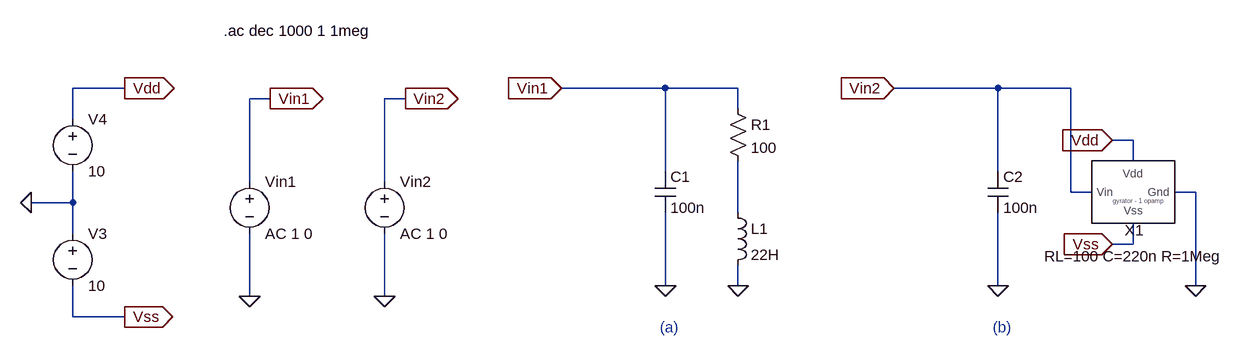
[diagram p0: schematic parallel resonant circuit.asc]
parallel resonant circuit.asc, the LTspice schematic file:
Version 4
SHEET 1 1184 680
WIRE -592 176 -672 176
WIRE 240 176 80 176
WIRE 352 176 240 176
WIRE 752 176 592 176
WIRE 864 176 752 176
WIRE -368 192 -400 192
WIRE -160 192 -192 192
WIRE 352 208 352 176
WIRE -672 224 -672 176
WIRE 960 256 928 256
WIRE 960 288 960 256
WIRE 240 304 240 176
WIRE 752 304 752 176
WIRE -400 320 -400 192
WIRE -192 320 -192 192
WIRE 864 336 864 176
WIRE 896 336 864 336
WIRE 1056 336 1024 336
WIRE -672 352 -672 304
WIRE -672 352 -736 352
WIRE 352 368 352 288
WIRE -672 400 -672 352
WIRE 960 416 960 384
WIRE 960 416 928 416
WIRE 240 480 240 368
WIRE 352 480 352 448
WIRE 752 480 752 368
WIRE 1056 480 1056 336
WIRE -400 496 -400 400
WIRE -192 496 -192 400
WIRE -672 528 -672 480
WIRE -592 528 -672 528
FLAG -400 496 0
FLAG 240 480 0
FLAG 352 480 0
FLAG -368 192 Vin1
IOPIN -368 192 Out
FLAG 80 176 Vin1
IOPIN 80 176 In
FLAG 752 480 0
FLAG 592 176 Vin2
IOPIN 592 176 In
FLAG 1056 480 0
FLAG -736 352 0
FLAG -592 176 Vdd
IOPIN -592 176 Out
FLAG -592 528 Vss
IOPIN -592 528 Out
FLAG 928 416 Vss
IOPIN 928 416 In
FLAG 928 256 Vdd
IOPIN 928 256 In
FLAG -192 496 0
FLAG -160 192 Vin2
IOPIN -160 192 Out
SYMBOL voltage -400 304 R0
WINDOW 123 0 0 Left 0
WINDOW 39 0 0 Left 0
SYMATTR InstName Vin1
SYMATTR Value AC 1 0
SYMBOL cap 224 304 R0
SYMATTR InstName C1
SYMATTR Value 100n
SYMBOL res 336 192 R0
SYMATTR InstName R1
SYMATTR Value 100
SYMBOL ind 336 352 R0
SYMATTR InstName L1
SYMATTR Value 22H
SYMBOL cap 736 304 R0
SYMATTR InstName C2
SYMATTR Value 100n
SYMBOL Gyr1 960 352 R0
WINDOW 39 2 98 Bottom 2
SYMATTR InstName X1
SYMATTR SpiceLine RL=100 C=220n R=1Meg
SYMBOL voltage -672 208 R0
WINDOW 123 0 0 Left 0
WINDOW 39 0 0 Left 0
SYMATTR InstName V4
SYMATTR Value 10
SYMBOL voltage -672 384 R0
WINDOW 123 0 0 Left 0
WINDOW 39 0 0 Left 0
SYMATTR InstName V3
SYMATTR Value 10
SYMBOL voltage -192 304 R0
WINDOW 123 0 0 Left 0
WINDOW 39 0 0 Left 0
SYMATTR InstName Vin2
SYMATTR Value AC 1 0
TEXT -440 88 Left 2 !.ac dec 1000 1 1meg
TEXT 232 544 Left 2 ;(a)
TEXT 744 544 Left 2 ;(b)

The netlist it stands for:
* parallel resonant circuit.asc
Vin1 Vin1 0 AC 1 0
C1 Vin1 0 100n
R1 Vin1 N001 100
L1 N001 0 22H
C2 Vin2 0 100n
XX1 Vdd Vss 0 Vin2 G1 RL=100 C=220n R=1Meg  ; pins Vdd Vss Gnd Vin
V4 Vdd 0 10
V3 0 Vss 10
Vin2 Vin2 0 AC 1 0
.ac dec 1000 1 1meg
* (a)
* (b)
.backanno
.end